# EAGLE schematic tda7418 (EAGLE 8.1.1)
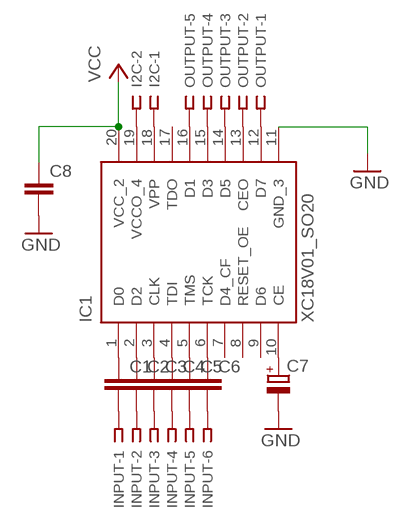
[diagram p0: schematic, sheet 1]

## Parts
C1  C5/2.5  [C5B2.5]
C2  C5/2.5  [C5B2.5]
C3  C5/2.5  [C5B2.5]
C4  C5/2.5  [C5B2.5]
C5  C5/2.5  [C5B2.5]
C6  C5/2.5  [C5B2.5]
C7  CPOL-EUE5-4  [E5-4]
C8  C-EU050-035X075  [C050-035X075]
I2C  SSW-102-02-S-S  [SSW-102-02-S-S]
IC1  XC18V01_SO20  [SOP20]
INPUT  SSW-106-02-S-S  [SSW-106-02-S-S]
OUTPUT  SSW-105-02-S-S  [SSW-105-02-S-S]

## Nets
GND: C7.- C8.2 IC1.11(GND_3)
N$1: C1.1 IC1.1(D0)
N$2: C2.1 IC1.2(D2)
N$3: C3.1 IC1.3(CLK)
N$4: C4.1 IC1.4(TDI)
N$5: C5.1 IC1.5(TMS)
N$6: C6.1 IC1.6(TCK)
N$7: C7.+ IC1.10(CE)
N$9: C1.2 INPUT.1
N$10: C2.2 INPUT.2
N$11: C3.2 INPUT.3
N$12: C4.2 INPUT.4
N$13: C5.2 INPUT.5
N$14: C6.2 INPUT.6
N$15: IC1.12(D7) OUTPUT.1
N$16: IC1.13(CEO) OUTPUT.2
N$17: IC1.14(D5) OUTPUT.3
N$18: IC1.15(D3) OUTPUT.4
N$19: IC1.16(D1) OUTPUT.5
N$20: I2C.1 IC1.18(VPP)
N$21: I2C.2 IC1.19(VCCO_4)
VCC: C8.1 IC1.20(VCC_2)
Unconnected: IC1.7(D4_CF) IC1.8(RESET_OE) IC1.9(D6) IC1.17(TDO)

## Library data of the parts
C1-C6 = capacitor-wima:C: CAPACITOR naming: grid - package width
C7 = resistor:CPOL-EU: POLARIZED CAPACITOR, European symbol
C8 = resistor:C-EU: CAPACITOR, European symbol
I2C = con-samtec:SSW-102-02-S-S: THROUGH-HOLE .025" SQ POST SOCKET Source: Samtec SSW.pdf; MPN: SSW-102-02-S-S; OC_FARNELL: unknown; OC_NEWARK: 11P9351
IC1 = xilinx-xc18v:XC18V01_SO20: xc18v01_so20 edit this description Auto generated by make-symbol-device-package-bsdl.ulp Rev. 26 Source: xc18v01_so20.bsd; OC_FARNELL: unknown; OC_NEWARK: unknown
INPUT = con-samtec:SSW-106-02-S-S: THROUGH-HOLE .025" SQ POST SOCKET Source: Samtec SSW.pdf; MPN: SSW-106-02-S-S; OC_FARNELL: unknown; OC_NEWARK: 11P9416
OUTPUT = con-samtec:SSW-105-02-S-S: THROUGH-HOLE .025" SQ POST SOCKET Source: Samtec SSW.pdf; MPN: SSW-105-02-S-S; OC_FARNELL: unknown; OC_NEWARK: 11P9399